# Altium schematic sheet POWER.SchDoc: Arm - Power
size Letter; DrawnBy: K.Hong; Organization: UW Robotics; Address1: 200 University Avenue; Address2: Waterloo; Address3: Ontario; Address4: Canada N2L 3G6; SheetNumber: 5; SheetTotal: 9
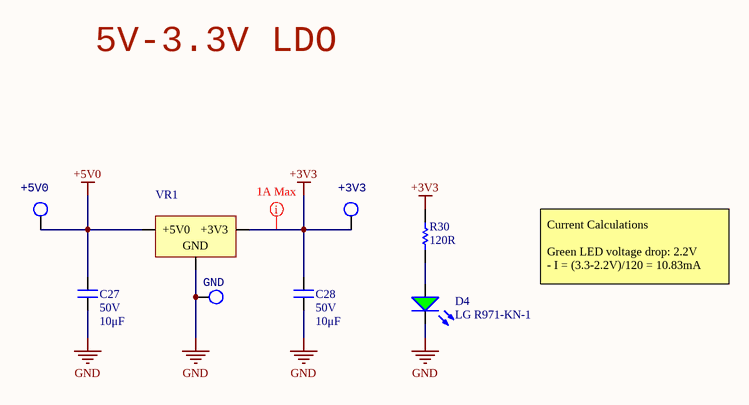
[diagram p0: POWER.SchDoc]

## Parts
+3V3  TESTPOINT_LOOP  [TESTPOINT_LOOP]  (value not drawn)
+5V0  TESTPOINT_LOOP  [TESTPOINT_LOOP]  (value not drawn)
C27  value 10μF  Voltage Rating: 50V  [CAPC1206(3216)]  (hidden comment: 10uF)
C28  value 10μF  Voltage Rating: 50V  [CAPC1206(3216)]  (hidden comment: 10uF)
D4  LG R971-KN-1  [LED_0805_LINE]
GND  TESTPOINT_LOOP  [TESTPOINT_LOOP]  (value not drawn)
R30  value 120R  [RESC0603(1608)_N]  (hidden comment: RES_120R_0603)
VR1  5V0_3V3_LDO  [D2PAK_M]  (value not drawn)

## Nets
+3V3: +3V3.1 C28.1 R30.2 VR1.2(+3V3)
+5V0: +5V0.1 C27.1 VR1.3(+5V0)
GND: C27.2 C28.2 D4.2(K) GND.1 VR1.1(GND)
NetD4_1: D4.1(A) R30.1

## Layout directives
mark named 1A Max: +3V3

## Notes on the sheet
- 5V-3.3V LDO
- Current Calculations
  Green LED voltage drop: 2.2V
  - I = (3.3-2.2V)/120 = 10.83mA
- Title
- Size:
- Date:
- Letter
- Drawn By:
- Sheet
- of
- File:

## Library data of the parts
+3V3 +5V0 GND = TESTPOINT_LOOP: Loop testpoint through-hole pad; Manufacturer Part Number 1: 5002; Manufacturer 1: Keystone Electronics; Supplier Part Number 1: 36-5002-ND; Supplier 1: Digi-Key; Mount: Through Hole
C27 C28 = CAP_10uF_50V_1206: CAP CER 10UF 50V X5R 1206; Manufacturer Part Numer 1: GRT31CR61H106KE01L; Manufacturer 1: Murata; Dimensions: 0.126" L x 0.063" W (3.20mm x 1.6mm); Package: 1206 (3216 Metric); Supplier Part Number 1: 490-12456-1-ND; Supplier 1: Digi-Key; Mount: Surface Mount; Case Code (Imperial): 1206; Case Code (Metric): 3216; Manufacturer Part Number 1: GRT31CR61H106KE01L; Dielectric: X5R
D4 = DIO_LED_G: LED GREEN DIFFUSED 0805 SMD; Manufacturer 1: OSRAM; Forward Voltage Drop: 2.2V; Package: 0805 (2012 Metric); Supplier Part Number 1: 475-1410-1-ND; Supplier 1: Digi-Key; Manufacturer Part Number 1: LG R971-KN-1; Mount: Surface Mount
R30 = RES_120R_0603: RES SMD 120 OHM 5% 1/10W 0603; Manufacturer: Yageo; MPN: RC0603JR-07120RL; Package: 0603 (1608 Metric); Dimensions: 0.063" L x 0.031" W (1.60mm x 0.80mm); Tolerance: 5%; Supplier Part Number 1: 311-120GRCT-ND; Supplier 1: Digi-Key
VR1 = 5V0_3V3_LDO: IC REG LINEAR 3.3V 1A DPAK; Manufacturer Part Number 1: NCP1117DT33T5G; Manufacturer 1: ON Semiconductor; Current Output: 1A; Supplier Part Number 1: NCP1117DT33T5GOSCT-ND; Supplier 1: Digi-Key; Mount: Surface Mount